# Altium schematic sheet auto-discharge.SchDoc
size A
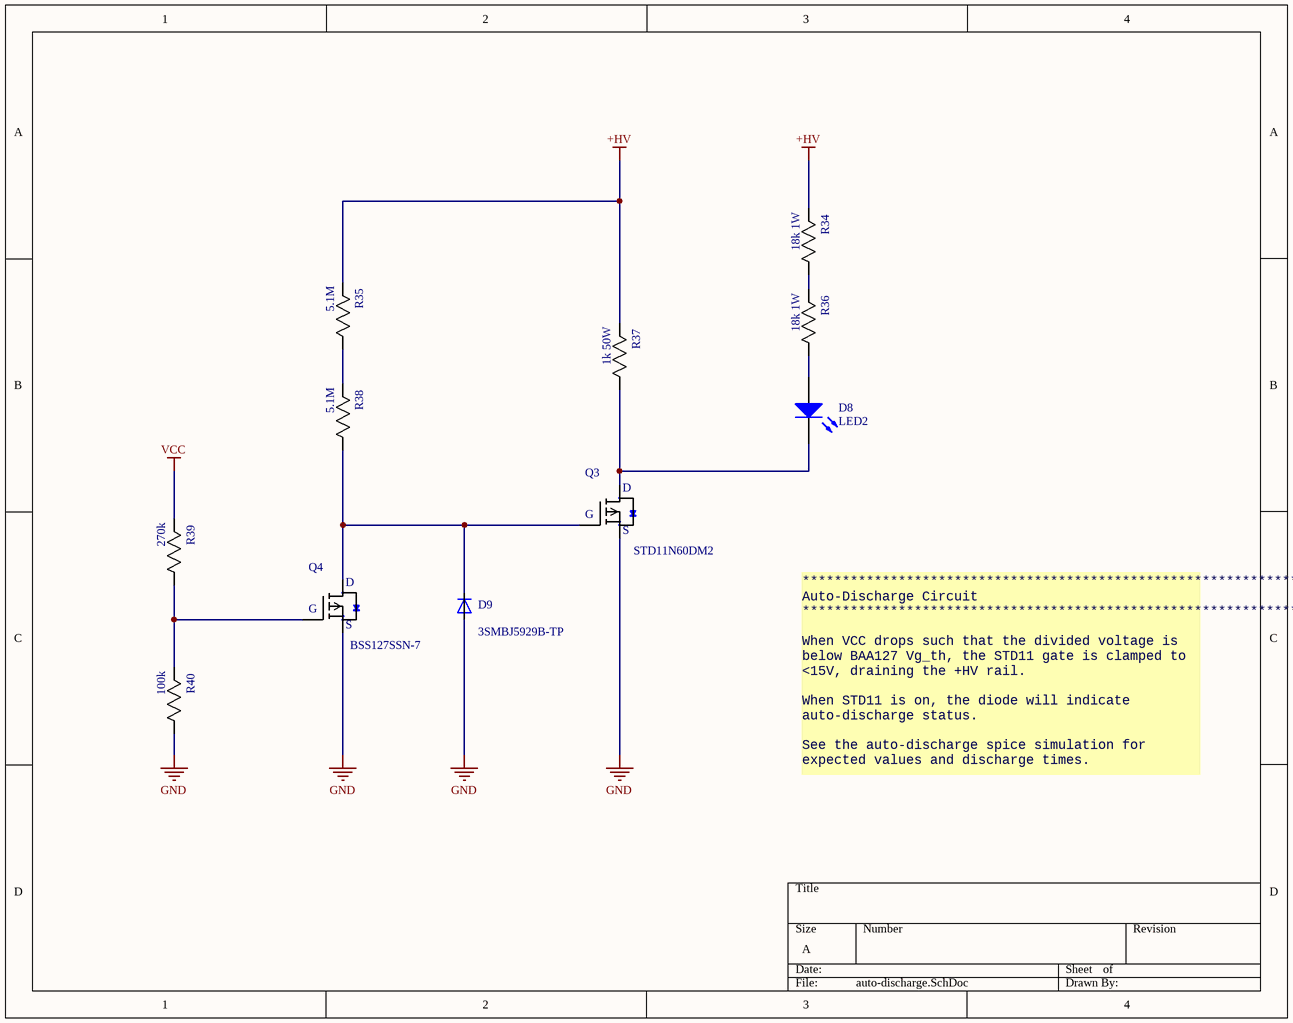
[diagram p0: auto-discharge.SchDoc]

## Parts
D8  LED2  [3.2X1.6X1.1]
D9  3SMBJ5929B-TP  [DO-214AA]
Q3  STD11N60DM2  [DPAK (TO-252)]
Q4  BSS127SSN-7  [SOT-23 (3)]
R34  18k 1W  [2512]
R35  5.1M  [0805]
R36  18k 1W  [2512]
R37  1k 50W  [D2PAK (TO-263)]
R38  5.1M  [0805]
R39  270k  [0805]
R40  100k  [0805]

## Nets
+HV: R34.2(R2) R35.2(R2) R37.2(R2)
GND: D9.A Q3.S Q4.S R40.1(R1)
VCC: R39.2(R2)
NetD8_1: D8.1(A) R36.1(R1)
NetD8_2: D8.2(K) Q3.D R37.1(R1)
NetD9_C: D9.C Q3.G Q4.D R38.1(R1)
NetQ4_G: Q4.G R39.1(R1) R40.2(R2)
NetR34_1: R34.1(R1) R36.2(R2)
NetR35_1: R35.1(R1) R38.2(R2)

## Notes on the sheet
- **********************************************************************
  Auto-Discharge Circuit
  **********************************************************************
  When VCC drops such that the divided voltage is below BAA127 Vg_th, the STD11 gate is clamped to <15V, draining the +HV rail.
  When STD11 is on, the diode will indicate auto-discharge status.
  See the auto-discharge spice simulation for expected values and discharge times.

## Library data of the parts
D8 = LED RED SMD: Typical RED, GREEN, YELLOW, AMBER GaAs LED; Lens Color: Colorless; Voltage - Forward (Vf) (Typ): 1.7V; Current - Test: 20mA; Lens Transparency: Clear; Color: Red; Package: 1206
D9 = DIODE ZENER 15V 3W: Supplier 1: Digi-Key; Supplier Part Number 1: 3SMBJ5929BTPMSCT-ND
Q3 = STD11N60DM2: pin to pad: D>2 G>1 S>3; MFG: STMicroelectronics; Supplier: Digikey; Supplier PN: 497-16925-1-ND
Q4 = BSS127SSN-7: Small Signal N-Ch, 600Vds; pin to pad: D>2 G>1 S>3; MFG: Diodes Incorporated; Supplier: Digikey; Supplier PN: BSS127SSN-7DICT-ND
R34 R36 = RES 18k 1W: RES SMD 18K OHM 5% 1W 2512; Package: 0805; Value: 18k; Power (Watts): 1W; Tolerance: 5%
R35 R38 = RES 5.1M 1/8W-5%: RES SMD 5.1 MOHM 5% 1/8W 0805; Power (Watts): 0.125W; Package: 0805; Value: 5.1M; Tolerance: 5%
R37 = RES 1.5k 50W: RES SMD 1.5K OHM 1% 50W D2PAK; Package: D2PAK (TO-263); Value: 1.5k; Power (Watts): 50W; Tolerance: 1%
R39 = RES 270k 1/8W: RES SMD 270K OHM 5% 1/8W 0805; Power (Watts): 0.125W; Package: 0805; Value: 270k; Tolerance: 5%
R40 = RES 100k 1/8W - 1%: RES SMD 100K OHM 1% 1/8W 0805; Power (Watts): 0.125W; Package: 0805; Value: 100k; Tolerance: 1%